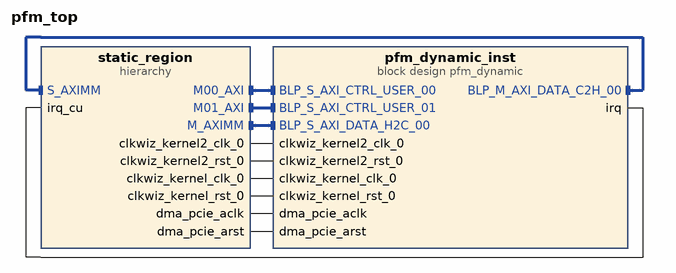
[diagram p0: block diagram of the top level]
# Vivado block design pfm_top, xcu50-fsvh2104-2-e, Vivado 2022.1
create_bd_design pfm_top

create_bd_cell -type hier static_region
create_bd_cell -type container -reference pfm_dynamic pfm_dynamic_inst

# ---- hierarchy /static_region ----
current_bd_instance /static_region
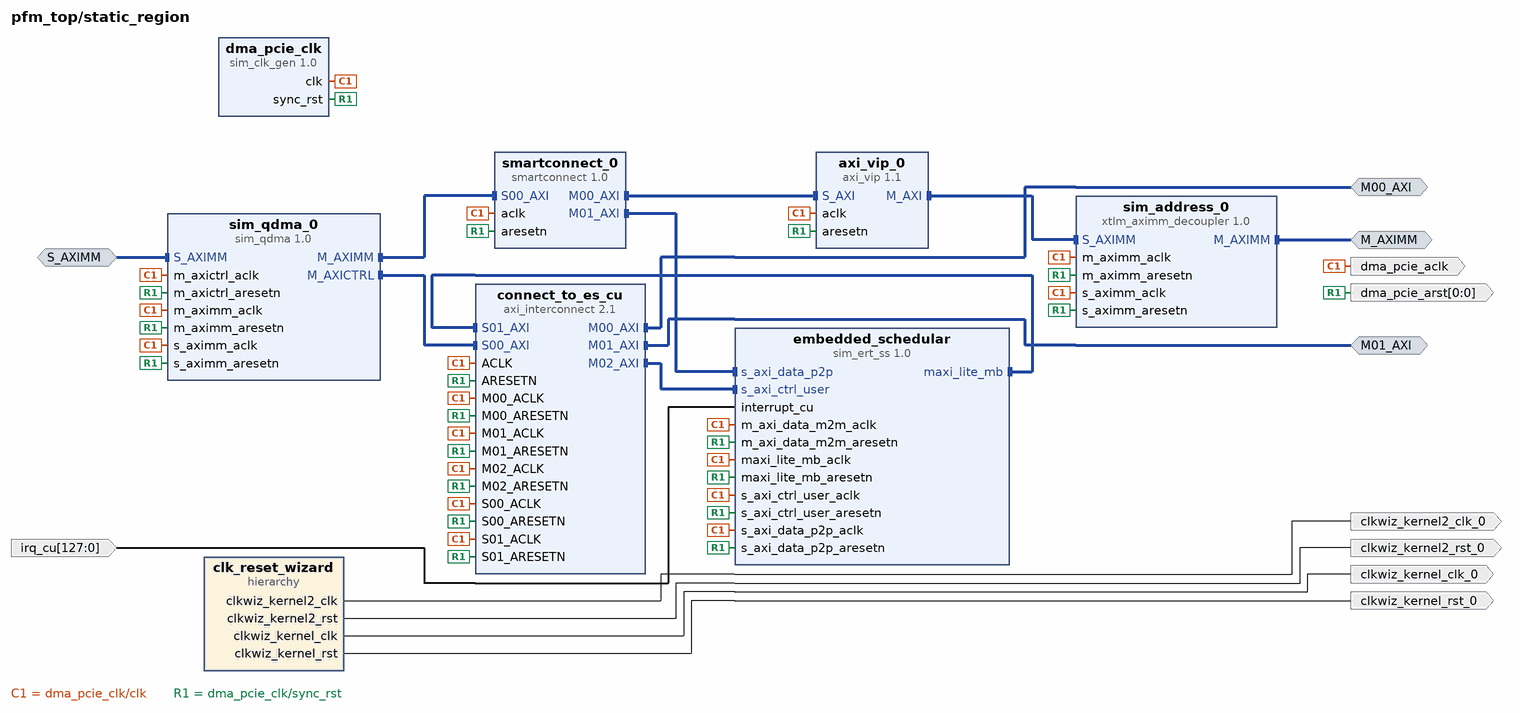
[diagram p1: block diagram inside /static_region]
create_bd_intf_pin -mode Master -vlnv xilinx.com:interface:aximm_rtl:1.0 M_AXIMM
create_bd_intf_pin -mode Master -vlnv xilinx.com:interface:aximm_rtl:1.0 M00_AXI
create_bd_intf_pin -mode Master -vlnv xilinx.com:interface:aximm_rtl:1.0 M01_AXI
create_bd_intf_pin -mode Slave -vlnv xilinx.com:interface:aximm_rtl:1.0 S_AXIMM
create_bd_pin -dir O -type clk clkwiz_kernel2_clk_0
create_bd_pin -dir O -type clk clkwiz_kernel_clk_0
create_bd_pin -dir O -type rst clkwiz_kernel2_rst_0
create_bd_pin -dir O -type rst clkwiz_kernel_rst_0
create_bd_pin -dir O -type clk dma_pcie_aclk
create_bd_pin -dir I -from 127 -to 0 -type intr irq_cu
create_bd_pin -dir O -from 0 -to 0 -type rst dma_pcie_arst

create_bd_cell -type hier clk_reset_wizard
create_bd_cell -type ip -vlnv xilinx.com:ip:sim_clk_gen:1.0 dma_pcie_clk
set_property -dict {CONFIG.CLOCK_CYCLES_BEFORE_SHUTDOWN 150 CONFIG.FREQ_HZ 300000000.0} [get_bd_cells dma_pcie_clk]
create_bd_cell -type ip -vlnv xilinx:ip:sim_ert_ss:1.0 embedded_schedular
set_property -dict [list \
  CONFIG.C_m_axi_data_m2m_ARUSER_WIDTH 0 \
  CONFIG.C_m_axi_data_m2m_AWUSER_WIDTH 0 \
  CONFIG.C_m_axi_data_m2m_BUSER_WIDTH 0 \
  CONFIG.C_m_axi_data_m2m_ID_WIDTH 0 \
  CONFIG.C_m_axi_data_m2m_RUSER_WIDTH 0 \
  CONFIG.C_m_axi_data_m2m_WUSER_WIDTH 0 \
  CONFIG.C_m_axi_data_m2m_enable false \
] [get_bd_cells embedded_schedular]
create_bd_cell -type ip -vlnv xilinx.com:ip:axi_vip:1.1 axi_vip_0
set_property -dict {CONFIG.INTERFACE_MODE PASS_THROUGH} [get_bd_cells axi_vip_0]
create_bd_cell -type ip -vlnv xilinx.com:ip:xtlm_aximm_decoupler:1.0 sim_address_0
set_property -dict {CONFIG.C_M_AXIMM_ADDR_WIDTH 64} [get_bd_cells sim_address_0]
create_bd_cell -type ip -vlnv xilinx.com:ip:sim_qdma:1.0 sim_qdma_0
set_property -dict [list \
  CONFIG.C_M_AXICTRL_ADDR_WIDTH 64 \
  CONFIG.C_M_AXICTRL_DATA_WIDTH 32 \
  CONFIG.C_M_AXIMM_ADDR_WIDTH 64 \
  CONFIG.C_M_AXIMM_ARUSER_WIDTH 32 \
  CONFIG.C_M_AXIMM_AUX_ENABLE false \
  CONFIG.C_M_AXIMM_AWUSER_WIDTH 32 \
  CONFIG.C_M_AXIMM_DATA_WIDTH 32 \
  CONFIG.C_M_AXIMM_RUSER_WIDTH 32 \
  CONFIG.C_M_AXIMM_WUSER_WIDTH 32 \
  CONFIG.C_STM_ITF_ENABLE false \
  CONFIG.C_S_AXIMM_ENABLE true \
] [get_bd_cells sim_qdma_0]
create_bd_cell -type ip -vlnv xilinx.com:ip:smartconnect:1.0 smartconnect_0
set_property -dict {CONFIG.NUM_MI 2 CONFIG.NUM_SI 1} [get_bd_cells smartconnect_0]
create_bd_cell -type ip -vlnv xilinx.com:ip:axi_interconnect:2.1 connect_to_es_cu
set_property -dict {CONFIG.NUM_MI 3 CONFIG.NUM_SI 2} [get_bd_cells connect_to_es_cu]

# ---- hierarchy /static_region/clk_reset_wizard ----
current_bd_instance /static_region/clk_reset_wizard
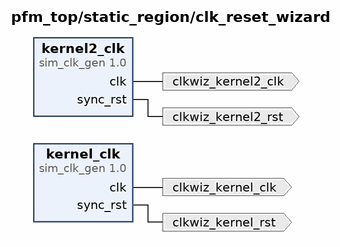
[diagram p2: block diagram inside /static_region/clk_reset_wizard]
create_bd_pin -dir O -type rst clkwiz_kernel2_rst
create_bd_pin -dir O -type rst clkwiz_kernel_rst
create_bd_pin -dir O -type clk clkwiz_kernel2_clk
create_bd_pin -dir O -type clk clkwiz_kernel_clk

create_bd_cell -type ip -vlnv xilinx.com:ip:sim_clk_gen:1.0 kernel2_clk
set_property -dict {CONFIG.CLOCK_CYCLES_BEFORE_SHUTDOWN 150 CONFIG.FREQ_HZ 500000000} [get_bd_cells kernel2_clk]
create_bd_cell -type ip -vlnv xilinx.com:ip:sim_clk_gen:1.0 kernel_clk
set_property -dict {CONFIG.CLOCK_CYCLES_BEFORE_SHUTDOWN 150 CONFIG.FREQ_HZ 300000000} [get_bd_cells kernel_clk]

# ---- connections ----

current_bd_instance /static_region
connect_bd_intf_net [get_bd_intf_pins M_AXIMM] [get_bd_intf_pins sim_address_0/M_AXIMM]
connect_bd_intf_net [get_bd_intf_pins M00_AXI] [get_bd_intf_pins connect_to_es_cu/M00_AXI]
connect_bd_intf_net [get_bd_intf_pins M01_AXI] [get_bd_intf_pins connect_to_es_cu/M01_AXI]
connect_bd_intf_net [get_bd_intf_pins S_AXIMM] [get_bd_intf_pins sim_qdma_0/S_AXIMM]
connect_bd_intf_net [get_bd_intf_pins axi_vip_0/M_AXI] [get_bd_intf_pins sim_address_0/S_AXIMM]
connect_bd_intf_net [get_bd_intf_pins connect_to_es_cu/M02_AXI] [get_bd_intf_pins embedded_schedular/s_axi_ctrl_user]
connect_bd_intf_net -intf_net sim_ert_subsystem_0_maxi_lite_mb [get_bd_intf_pins connect_to_es_cu/S01_AXI] [get_bd_intf_pins embedded_schedular/maxi_lite_mb]
connect_bd_intf_net [get_bd_intf_pins sim_qdma_0/M_AXICTRL] [get_bd_intf_pins connect_to_es_cu/S00_AXI]
connect_bd_intf_net [get_bd_intf_pins sim_qdma_0/M_AXIMM] [get_bd_intf_pins smartconnect_0/S00_AXI]
connect_bd_intf_net [get_bd_intf_pins axi_vip_0/S_AXI] [get_bd_intf_pins smartconnect_0/M00_AXI]
connect_bd_intf_net [get_bd_intf_pins embedded_schedular/s_axi_data_p2p] [get_bd_intf_pins smartconnect_0/M01_AXI]
connect_bd_net -net clk_clkwiz_kernel2_clk [get_bd_pins clk_reset_wizard/clkwiz_kernel2_clk] [get_bd_pins clkwiz_kernel2_clk_0]
connect_bd_net -net clk_clkwiz_kernel2_rst [get_bd_pins clk_reset_wizard/clkwiz_kernel2_rst] [get_bd_pins clkwiz_kernel2_rst_0]
connect_bd_net -net clk_clkwiz_kernel_clk [get_bd_pins clk_reset_wizard/clkwiz_kernel_clk] [get_bd_pins clkwiz_kernel_clk_0]
connect_bd_net -net clk_clkwiz_kernel_rst [get_bd_pins clk_reset_wizard/clkwiz_kernel_rst] [get_bd_pins clkwiz_kernel_rst_0]
connect_bd_net [get_bd_pins dma_pcie_clk/clk] \
  [get_bd_pins axi_vip_0/aclk] [get_bd_pins sim_address_0/m_aximm_aclk] [get_bd_pins sim_address_0/s_aximm_aclk] \
  [get_bd_pins sim_qdma_0/s_aximm_aclk] [get_bd_pins dma_pcie_aclk] [get_bd_pins embedded_schedular/maxi_lite_mb_aclk] \
  [get_bd_pins embedded_schedular/s_axi_ctrl_user_aclk] [get_bd_pins embedded_schedular/s_axi_data_p2p_aclk] \
  [get_bd_pins embedded_schedular/m_axi_data_m2m_aclk] [get_bd_pins sim_qdma_0/m_axictrl_aclk] \
  [get_bd_pins sim_qdma_0/m_aximm_aclk] [get_bd_pins smartconnect_0/aclk] [get_bd_pins connect_to_es_cu/ACLK] \
  [get_bd_pins connect_to_es_cu/S00_ACLK] [get_bd_pins connect_to_es_cu/S01_ACLK] [get_bd_pins connect_to_es_cu/M00_ACLK] \
  [get_bd_pins connect_to_es_cu/M01_ACLK] [get_bd_pins connect_to_es_cu/M02_ACLK]
connect_bd_net [get_bd_pins dma_pcie_clk/sync_rst] \
  [get_bd_pins axi_vip_0/aresetn] [get_bd_pins sim_address_0/m_aximm_aresetn] [get_bd_pins sim_address_0/s_aximm_aresetn] \
  [get_bd_pins sim_qdma_0/s_aximm_aresetn] [get_bd_pins dma_pcie_arst] [get_bd_pins embedded_schedular/maxi_lite_mb_aresetn] \
  [get_bd_pins embedded_schedular/s_axi_ctrl_user_aresetn] [get_bd_pins embedded_schedular/s_axi_data_p2p_aresetn] \
  [get_bd_pins sim_qdma_0/m_axictrl_aresetn] [get_bd_pins embedded_schedular/m_axi_data_m2m_aresetn] \
  [get_bd_pins sim_qdma_0/m_aximm_aresetn] [get_bd_pins smartconnect_0/aresetn] [get_bd_pins connect_to_es_cu/ARESETN] \
  [get_bd_pins connect_to_es_cu/S00_ARESETN] [get_bd_pins connect_to_es_cu/S01_ARESETN] \
  [get_bd_pins connect_to_es_cu/M00_ARESETN] [get_bd_pins connect_to_es_cu/M01_ARESETN] \
  [get_bd_pins connect_to_es_cu/M02_ARESETN]
connect_bd_net [get_bd_pins irq_cu] [get_bd_pins embedded_schedular/interrupt_cu]

current_bd_instance /static_region/clk_reset_wizard
connect_bd_net [get_bd_pins kernel2_clk/clk] [get_bd_pins clkwiz_kernel2_clk]
connect_bd_net [get_bd_pins kernel2_clk/sync_rst] [get_bd_pins clkwiz_kernel2_rst]
connect_bd_net [get_bd_pins kernel_clk/clk] [get_bd_pins clkwiz_kernel_clk]
connect_bd_net [get_bd_pins kernel_clk/sync_rst] [get_bd_pins clkwiz_kernel_rst]

current_bd_instance /
connect_bd_intf_net [get_bd_intf_pins pfm_dynamic_inst/BLP_M_AXI_DATA_C2H_00] [get_bd_intf_pins static_region/S_AXIMM]
connect_bd_intf_net [get_bd_intf_pins pfm_dynamic_inst/BLP_S_AXI_CTRL_USER_00] [get_bd_intf_pins static_region/M00_AXI]
connect_bd_intf_net [get_bd_intf_pins pfm_dynamic_inst/BLP_S_AXI_CTRL_USER_01] [get_bd_intf_pins static_region/M01_AXI]
connect_bd_intf_net [get_bd_intf_pins pfm_dynamic_inst/BLP_S_AXI_DATA_H2C_00] [get_bd_intf_pins static_region/M_AXIMM]
connect_bd_net -net irq_cu_1 [get_bd_pins pfm_dynamic_inst/irq] [get_bd_pins static_region/irq_cu]
connect_bd_net [get_bd_pins static_region/clkwiz_kernel2_clk_0] [get_bd_pins pfm_dynamic_inst/clkwiz_kernel2_clk_0]
connect_bd_net [get_bd_pins static_region/clkwiz_kernel2_rst_0] [get_bd_pins pfm_dynamic_inst/clkwiz_kernel2_rst_0]
connect_bd_net [get_bd_pins static_region/clkwiz_kernel_clk_0] [get_bd_pins pfm_dynamic_inst/clkwiz_kernel_clk_0]
connect_bd_net [get_bd_pins static_region/clkwiz_kernel_rst_0] [get_bd_pins pfm_dynamic_inst/clkwiz_kernel_rst_0]
connect_bd_net [get_bd_pins static_region/dma_pcie_aclk] [get_bd_pins pfm_dynamic_inst/dma_pcie_aclk]
connect_bd_net [get_bd_pins static_region/dma_pcie_arst] [get_bd_pins pfm_dynamic_inst/dma_pcie_arst]

# ---- address map ----
assign_bd_address -offset 0x2000000000 -range 16G -target_address_space [get_bd_addr_spaces pfm_dynamic_inst/BLP_M_AXI_DATA_C2H_00] [get_bd_addr_segs static_region/sim_qdma_0/S_AXIMM/Reg]
assign_bd_address -offset 0x0000000000000000 -range 256K -target_address_space [get_bd_addr_spaces static_region/embedded_schedular/maxi_lite_mb] [get_bd_addr_segs static_region/embedded_schedular/s_axi_ctrl_user/s_axi_ctrl_user_reg]
assign_bd_address -offset 0x000000001C000000 -range 16M -target_address_space [get_bd_addr_spaces static_region/embedded_schedular/maxi_lite_mb] [get_bd_addr_segs pfm_dynamic_inst/BLP_S_AXI_CTRL_USER_00/Reg]
assign_bd_address -offset 0x000000001D000000 -range 16M -target_address_space [get_bd_addr_spaces static_region/embedded_schedular/maxi_lite_mb] [get_bd_addr_segs pfm_dynamic_inst/BLP_S_AXI_CTRL_USER_01/Reg]
assign_bd_address -offset 0x0000000000000000 -range 256G -target_address_space [get_bd_addr_spaces static_region/sim_address_0/M_AXIMM] [get_bd_addr_segs pfm_dynamic_inst/BLP_S_AXI_DATA_H2C_00/Mem]
assign_bd_address -offset 0x00000000 -range 256K -target_address_space [get_bd_addr_spaces static_region/sim_qdma_0/M_AXICTRL] [get_bd_addr_segs static_region/embedded_schedular/s_axi_ctrl_user/s_axi_ctrl_user_reg]
assign_bd_address -offset 0x1C000000 -range 16M -target_address_space [get_bd_addr_spaces static_region/sim_qdma_0/M_AXICTRL] [get_bd_addr_segs pfm_dynamic_inst/BLP_S_AXI_CTRL_USER_00/Reg]
assign_bd_address -offset 0x1D000000 -range 16M -target_address_space [get_bd_addr_spaces static_region/sim_qdma_0/M_AXICTRL] [get_bd_addr_segs pfm_dynamic_inst/BLP_S_AXI_CTRL_USER_01/Reg]
assign_bd_address -offset 0x0000000000000000 -range 512G -target_address_space [get_bd_addr_spaces static_region/sim_qdma_0/M_AXIMM] [get_bd_addr_segs static_region/sim_address_0/S_AXIMM/Reg]
assign_bd_address -offset 0x0000008000000000 -range 1M -target_address_space [get_bd_addr_spaces static_region/sim_qdma_0/M_AXIMM] [get_bd_addr_segs static_region/embedded_schedular/s_axi_data_p2p/s_axi_data_p2p_mem]

validate_bd_design
save_bd_design
